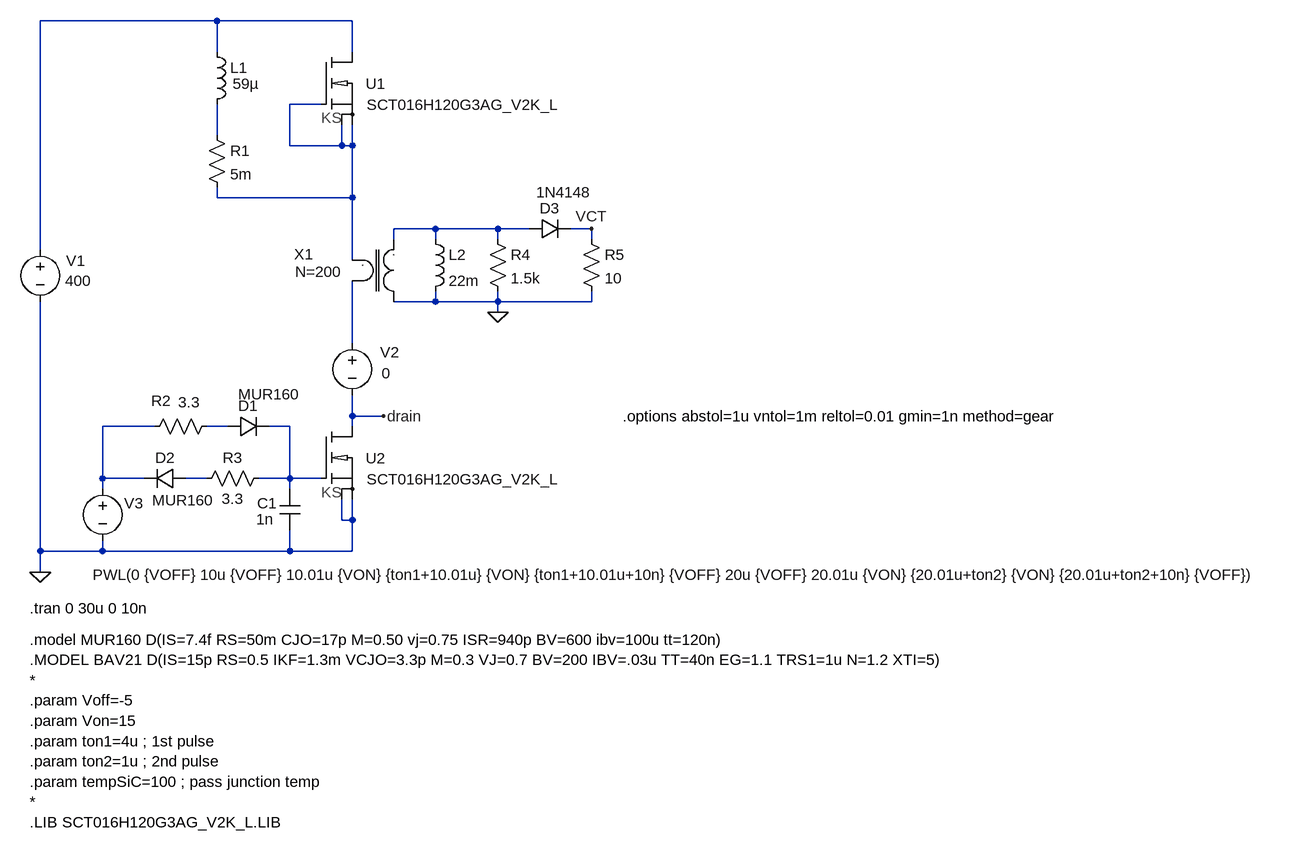
[diagram p0: schematic Double Pulse Test - ST - CT.asc]
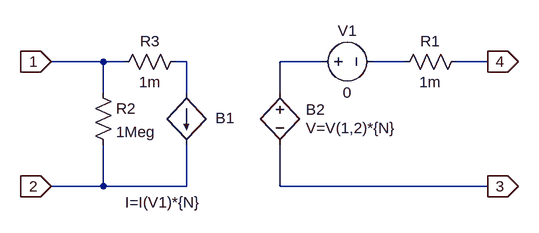
[diagram p1: sub-circuit ct_xfmr.asc]
Double Pulse Test - ST - CT.asc, the LTspice schematic file:
Version 4
SHEET 1 2024 868
WIRE 160 -352 -112 -352
WIRE 368 -352 160 -352
WIRE 160 -304 160 -352
WIRE 368 -304 368 -352
WIRE 320 -224 272 -224
WIRE 160 -176 160 -224
WIRE 272 -160 272 -224
WIRE 352 -160 352 -192
WIRE 352 -160 272 -160
WIRE 368 -160 368 -192
WIRE 368 -160 352 -160
WIRE 160 -80 160 -96
WIRE 368 -80 368 -160
WIRE 368 -80 160 -80
WIRE 496 -32 432 -32
WIRE 592 -32 496 -32
WIRE 640 -32 592 -32
WIRE 736 -32 704 -32
WIRE 432 -16 432 -32
WIRE 496 -16 496 -32
WIRE 592 -16 592 -32
WIRE 736 -16 736 -32
WIRE -112 0 -112 -352
WIRE 368 16 368 -80
WIRE 496 80 496 64
WIRE 496 80 432 80
WIRE 592 80 592 64
WIRE 592 80 496 80
WIRE 736 80 736 64
WIRE 736 80 592 80
WIRE 592 96 592 80
WIRE 368 144 368 48
WIRE 368 256 368 224
WIRE 416 256 368 256
WIRE 64 272 -16 272
WIRE 176 272 144 272
WIRE 272 272 240 272
WIRE 368 272 368 256
WIRE -16 352 -16 272
WIRE 48 352 -16 352
WIRE 144 352 112 352
WIRE 272 352 272 272
WIRE 272 352 224 352
WIRE 320 352 272 352
WIRE -16 368 -16 352
WIRE 272 368 272 352
WIRE 352 416 352 384
WIRE 368 416 368 384
WIRE 368 416 352 416
WIRE -112 464 -112 80
WIRE -16 464 -16 448
WIRE -16 464 -112 464
WIRE 272 464 272 432
WIRE 272 464 -16 464
WIRE 368 464 368 416
WIRE 368 464 272 464
WIRE -112 496 -112 464
FLAG 416 256 drain
FLAG -112 496 0
FLAG 592 96 0
FLAG 736 -32 VCT
SYMBOL voltage -112 -16 R0
WINDOW 0 40 33 Left 2
WINDOW 3 38 64 Left 2
SYMATTR InstName V1
SYMATTR Value 400
SYMBOL TO247_4L 320 -304 R0
WINDOW 3 70 81 Left 2
WINDOW 0 69 49 Left 2
SYMATTR Value SCT016H120G3AG_V2K_L
SYMATTR InstName U1
SYMBOL TO247_4L 320 272 R0
WINDOW 3 70 81 Left 2
WINDOW 0 69 49 Left 2
SYMATTR Value SCT016H120G3AG_V2K_L
SYMATTR InstName U2
SYMBOL ind 144 -320 R0
WINDOW 3 40 65 Left 2
SYMATTR Value 59µ
SYMATTR InstName L1
SYMBOL res 144 -192 R0
SYMATTR InstName R1
SYMATTR Value 5m
SYMBOL voltage 368 128 R0
WINDOW 0 43 30 Left 2
WINDOW 3 45 62 Left 2
WINDOW 123 0 0 Left 0
WINDOW 39 0 0 Left 0
SYMATTR InstName V2
SYMATTR Value 0
SYMBOL res 160 256 R90
WINDOW 0 -8 86 VBottom 2
WINDOW 3 -37 43 VTop 2
SYMATTR InstName R2
SYMATTR Value 3.3
SYMBOL diode 176 288 R270
WINDOW 0 32 32 VTop 2
WINDOW 3 81 64 VBottom 2
SYMATTR InstName D1
SYMATTR Value MUR160
SYMBOL res 128 368 R270
WINDOW 0 32 56 VTop 2
WINDOW 3 0 56 VBottom 2
SYMATTR InstName R3
SYMATTR Value 3.3
SYMBOL diode 112 336 R90
WINDOW 0 0 32 VBottom 2
WINDOW 3 34 4 VTop 2
SYMATTR InstName D2
SYMATTR Value MUR160
SYMBOL voltage -16 352 R0
WINDOW 0 33 38 Left 2
WINDOW 3 -15 148 Left 2
WINDOW 123 0 0 Left 0
WINDOW 39 0 0 Left 0
SYMATTR InstName V3
SYMATTR Value PWL(0 {VOFF} 10u {VOFF} 10.01u {VON} {ton1+10.01u} {VON} {ton1+10.01u+10n} {VOFF} 20u {VOFF} 20.01u {VON} {20.01u+ton2} {VON} {20.01u+ton2+10n} {VOFF})
SYMBOL cap 256 368 R0
WINDOW 0 -34 22 Left 2
WINDOW 3 -36 47 Left 2
SYMATTR InstName C1
SYMATTR Value 1n
SYMBOL CT_xfmr 416 16 R0
WINDOW 0 -123 7 Bottom 2
WINDOW 39 -100 34 Bottom 2
SYMATTR InstName X1
SYMATTR SpiceLine N=200
SYMBOL ind 480 -32 R0
SYMATTR InstName L2
SYMATTR Value 22m
SYMBOL res 576 -32 R0
SYMATTR InstName R4
SYMATTR Value 1.5k
SYMBOL diode 640 -16 R270
WINDOW 0 32 32 VTop 2
WINDOW 3 88 53 VBottom 2
SYMATTR InstName D3
SYMATTR Value 1N4148
SYMBOL res 720 -32 R0
SYMATTR InstName R5
SYMATTR Value 10
TEXT -128 552 Left 2 !.tran 0 30u 0 10n
TEXT -128 600 Left 2 !.model MUR160 D(IS=7.4f RS=50m CJO=17p M=0.50 vj=0.75 ISR=940p BV=600 ibv=100u tt=120n)\n.MODEL BAV21 D(IS=15p RS=0.5 IKF=1.3m VCJO=3.3p M=0.3 VJ=0.7 BV=200 IBV=.03u TT=40n EG=1.1 TRS1=1u N=1.2 XTI=5)\n*\n.param Voff=-5\n.param Von=15\n.param ton1=4u ; 1st pulse\n.param ton2=1u ; 2nd pulse\n.param tempSiC=100 ; pass junction temp\n*\n.LIB SCT016H120G3AG_V2K_L.LIB
TEXT 784 256 Left 2 !.options abstol=1u vntol=1m reltol=0.01 gmin=1n method=gear

ct_xfmr.asc, the sub-circuit schematic file:
Version 4
SHEET 1 880 680
WIRE 32 96 -48 96
WIRE 64 96 32 96
WIRE 160 96 144 96
WIRE 368 96 304 96
WIRE 496 96 448 96
WIRE 624 96 576 96
WIRE 32 144 32 96
WIRE 160 144 160 96
WIRE 304 144 304 96
WIRE 32 288 32 224
WIRE 32 288 -48 288
WIRE 160 288 160 224
WIRE 160 288 32 288
WIRE 304 288 304 224
WIRE 624 288 304 288
FLAG 624 96 4
IOPIN 624 96 Out
FLAG 624 288 3
IOPIN 624 288 Out
FLAG -48 96 1
IOPIN -48 96 In
FLAG -48 288 2
IOPIN -48 288 In
SYMBOL bi 160 144 R0
WINDOW 0 45 39 Left 2
WINDOW 3 -94 169 Left 2
SYMATTR InstName B1
SYMATTR Value I=I(V1)*{N}
SYMBOL bv 304 128 R0
WINDOW 0 40 42 Left 2
WINDOW 3 40 70 Left 2
SYMATTR InstName B2
SYMATTR Value V=V(1,2)*{N}
SYMBOL voltage 352 96 R270
WINDOW 0 32 56 VTop 2
WINDOW 3 -32 56 VBottom 2
WINDOW 123 0 0 Left 0
WINDOW 39 0 0 Left 0
SYMATTR InstName V1
SYMATTR Value 0
SYMBOL res 592 80 R90
WINDOW 0 0 56 VBottom 2
WINDOW 3 32 56 VTop 2
SYMATTR InstName R1
SYMATTR Value 1m
SYMBOL res 16 128 R0
SYMATTR InstName R2
SYMATTR Value 1Meg
SYMBOL res 160 80 R90
WINDOW 0 0 56 VBottom 2
WINDOW 3 32 56 VTop 2
SYMATTR InstName R3
SYMATTR Value 1m

The netlist it stands for:
* Double Pulse Test - ST - CT.asc
V1 N001 0 400
XU1 N001 N002 N002 N002 SCT016H120G3AG_V2K_L  ; pins D G S1 S2
XU2 drain N008 0 0 SCT016H120G3AG_V2K_L  ; pins D G S1 S2
L1 N001 N003 59µ
R1 N003 N002 5m
V2 N005 drain 0
R2 N007 N006 3.3
D1 N007 N008 MUR160
R3 N009 N008 3.3
D2 N009 N006 MUR160
V3 N006 0 PWL(0 {VOFF} 10u {VOFF} 10.01u {VON} {ton1+10.01u} {VON} {ton1+10.01u+10n} {VOFF} 20u {VOFF} 20.01u {VON} {20.01u+ton2} {VON} {20.01u+ton2+10n} {VOFF})
C1 N008 0 1n
XX1 N002 N005 0 N004 ct_xfmr params: N=200
L2 N004 0 22m
R4 N004 0 1.5k
D3 N004 VCT 1N4148
R5 VCT 0 10

* block symbol definitions
.subckt ct_xfmr 1 2 3 4
B1 N001 2 I=I(V1)*{N}
B2 N002 3 V=V(1,2)*{N}
V1 N002 N003 0
R1 4 N003 1m
R2 1 2 1Meg
R3 N001 1 1m
.ends ct_xfmr

.model D D
.lib standard.dio
.tran 0 30u 0 10n
.model MUR160 D(IS=7.4f RS=50m CJO=17p M=0.50 vj=0.75 ISR=940p BV=600 ibv=100u tt=120n)
.MODEL BAV21 D(IS=15p RS=0.5 IKF=1.3m VCJO=3.3p M=0.3 VJ=0.7 BV=200 IBV=.03u TT=40n EG=1.1 TRS1=1u N=1.2 XTI=5)
*
.param Voff=-5
.param Von=15
.param ton1=4u ; 1st pulse
.param ton2=1u ; 2nd pulse
.param tempSiC=100 ; pass junction temp
*
.LIB SCT016H120G3AG_V2K_L.LIB
.options abstol=1u vntol=1m reltol=0.01 gmin=1n method=gear
.backanno
.end